# EAGLE schematic Kord Kontroller PCB 0.2 (EAGLE 9.6.2)

## Sheet 1 of 2
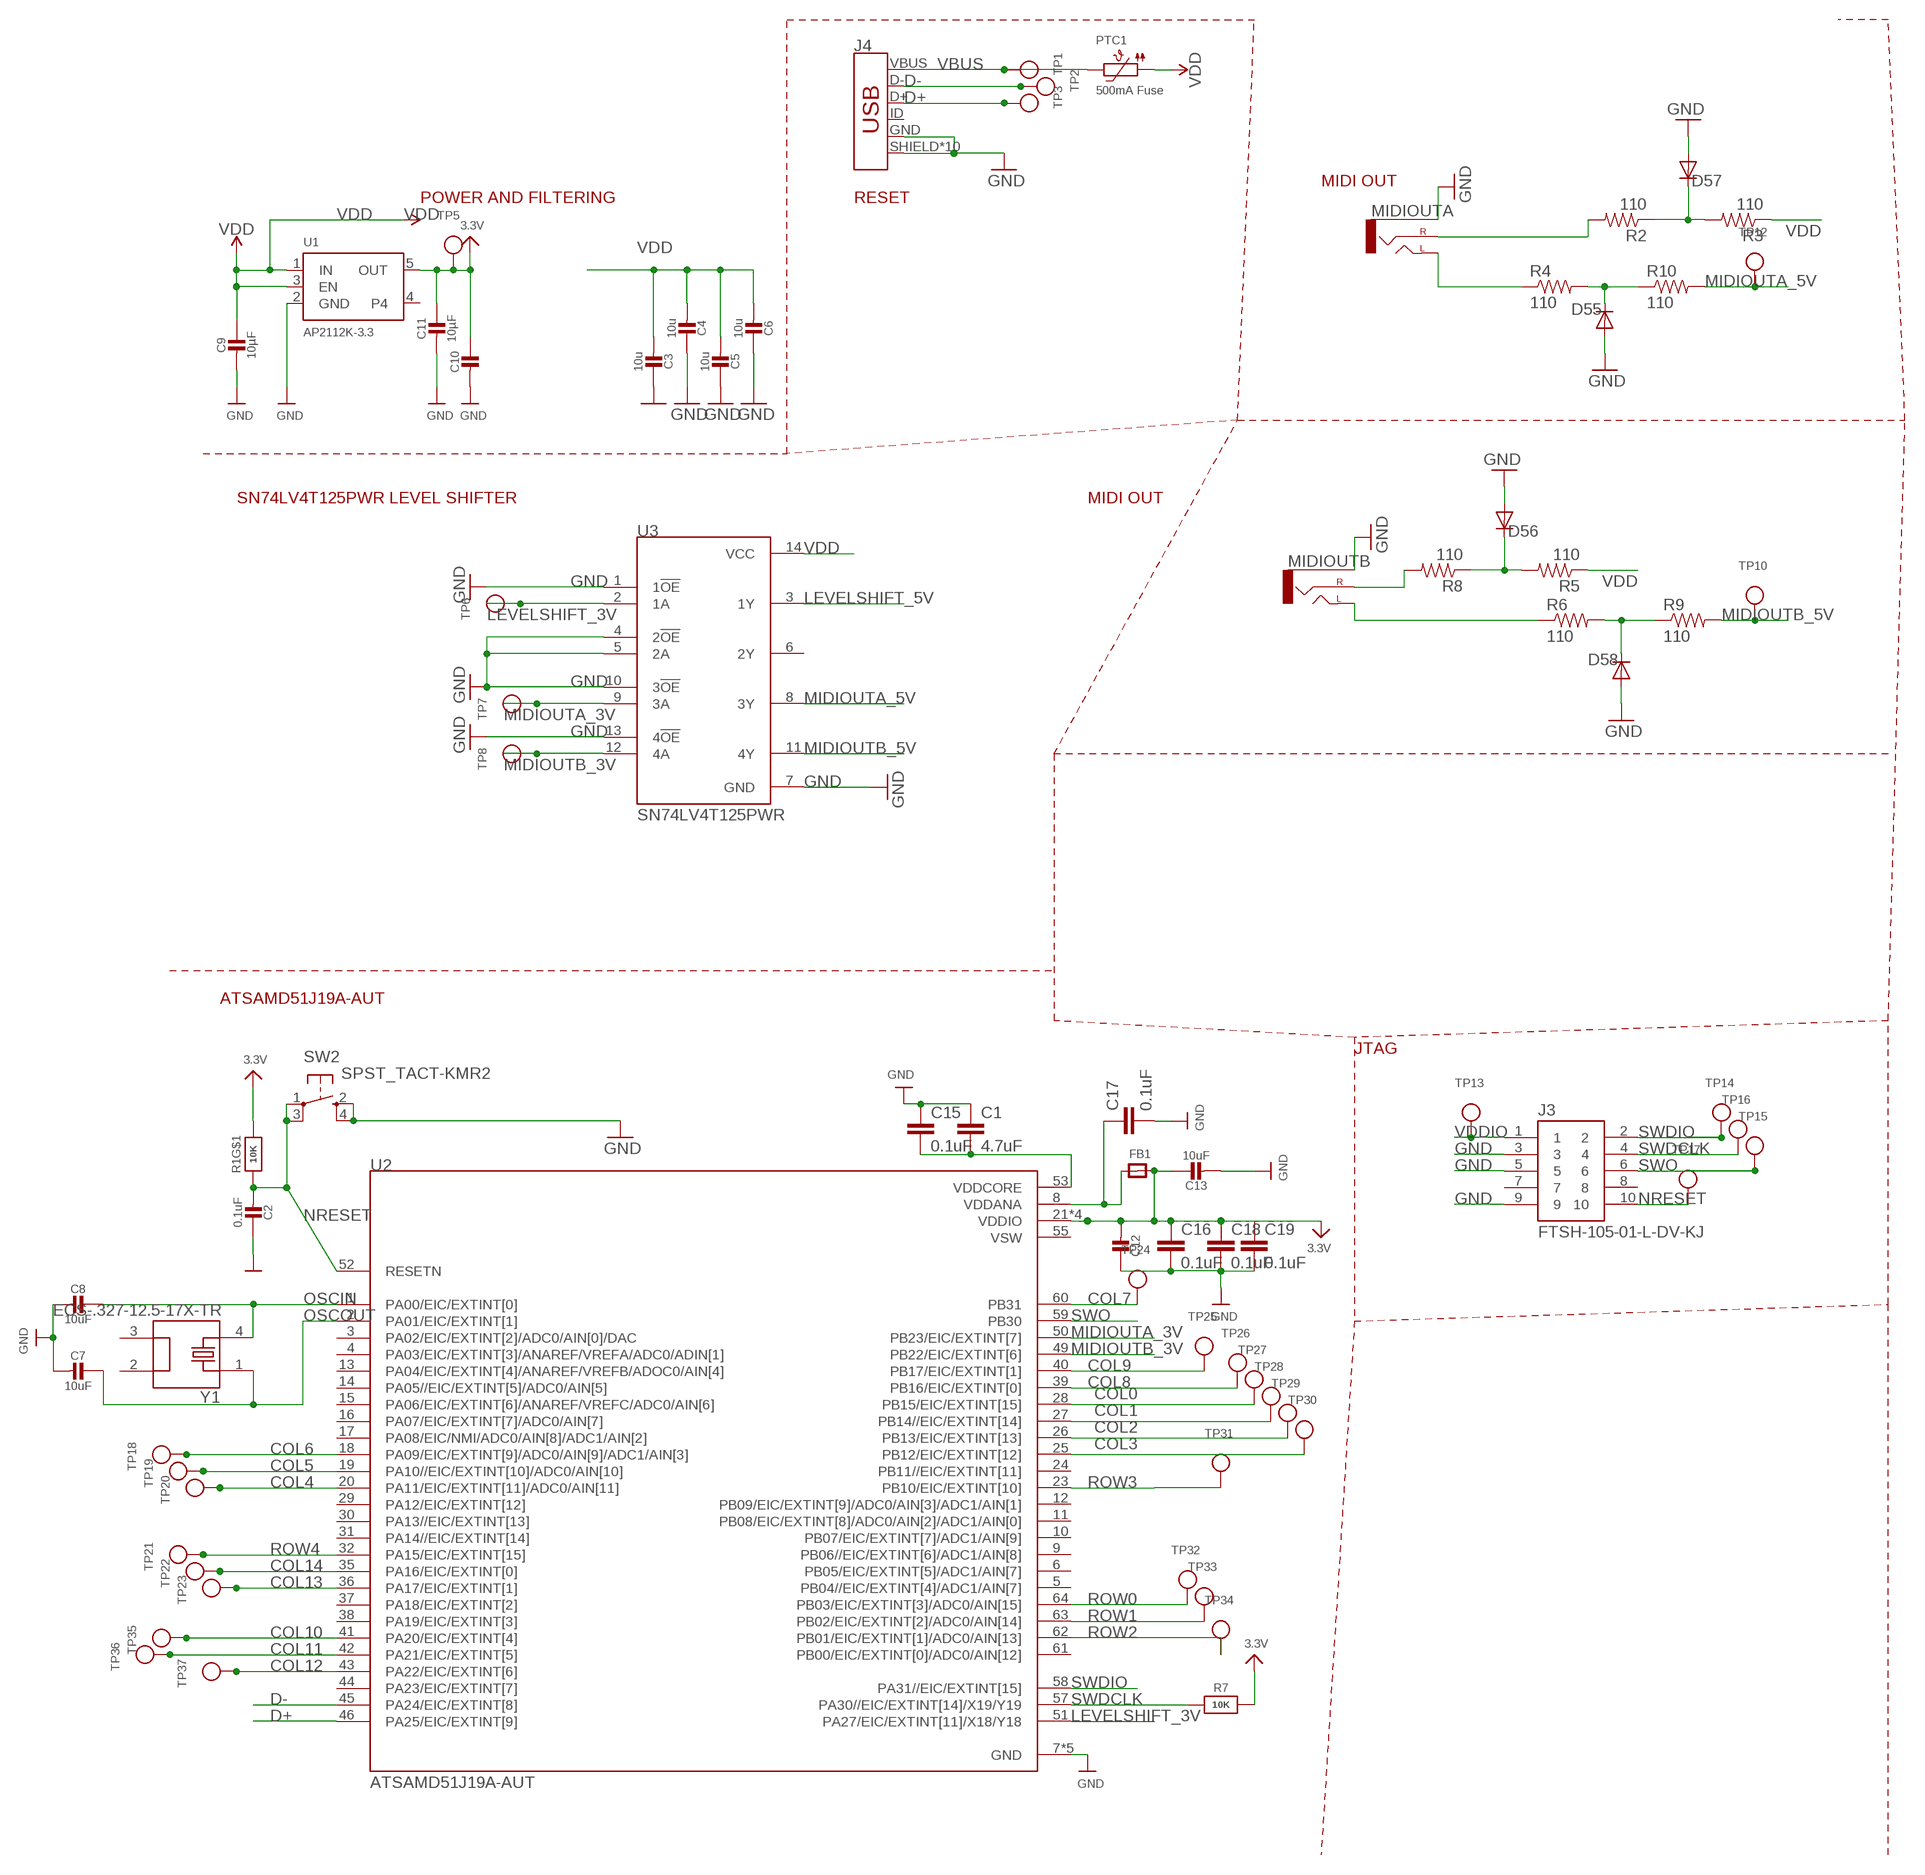
[diagram p0: schematic, sheet 1]

### Parts
C1  4.7uF  4.7UF-0603-6.3V-(10%)  [0603]
C2  0.1uF  CAP_CERAMIC0603_NO  [0603-NO]
C3  10u  CAP_CERAMIC0805-NOOUTLINE  [0805-NO]
C4  10u  CAP_CERAMIC0805-NOOUTLINE  [0805-NO]
C5  10u  CAP_CERAMIC0805-NOOUTLINE  [0805-NO]
C6  10u  CAP_CERAMIC0805-NOOUTLINE  [0805-NO]
C7  10uF  CAP_CERAMIC0805-NOOUTLINE  [0805-NO]
C8  10uF  CAP_CERAMIC0805-NOOUTLINE  [0805-NO]
C9  10µF  CAP_CERAMIC0805-NOOUTLINE  [0805-NO]
C10  1uF  CAP_CERAMIC0603_NO  [0603-NO]
C11  10µF  CAP_CERAMIC0805-NOOUTLINE  [0805-NO]
C12  1uF  CAP_CERAMIC0603_NO  [0603-NO]
C13  10uF  CAP_CERAMIC0805-NOOUTLINE  [0805-NO]
C15  0.1uF  0.1UF-0603-25V-(+80/-20%)  [0603]
C16  0.1uF  0.1UF-0603-25V-(+80/-20%)  [0603]
C17  0.1uF  0.1UF-0603-25V-(+80/-20%)  [0603]
C18  0.1uF  0.1UF-0603-25V-(+80/-20%)  [0603]
C19  0.1uF  0.1UF-0603-25V-(+80/-20%)  [0603]
D55  DIODE-SOD123  [SOD123]
D56  DIODE-SOD123  [SOD123]
D57  DIODE-SOD123  [SOD123]
D58  DIODE-SOD123  [SOD123]
FB1  FERRITE  [0603]
J3  FTSH-105-01-L-DV-KJ  [SAMTEC_FTSH-105-01-L-DV-K]
J4  USB_MICRO-B_HALF_PTH_MILL  [USB-MICROB-PTH-MILL]
MIDIOUTA  AUDIO_JACK_2.5MM_2.5MM_SMD  [STEREOJACK2.5MM]
MIDIOUTB  AUDIO_JACK_2.5MM_2.5MM_SMD  [STEREOJACK2.5MM]
PTC1  500mA Fuse  PTC1206  [1206]
R1  10K  RESISTOR_4PACK  [RESPACK_4X0603]
R2  110  220OHM-1/10W-1%(0603)  [0603-RES]
R3  110  220OHM-1/10W-1%(0603)  [0603-RES]
R4  110  220OHM-1/10W-1%(0603)  [0603-RES]
R5  110  220OHM-1/10W-1%(0603)  [0603-RES]
R6  110  220OHM-1/10W-1%(0603)  [0603-RES]
R7  10K  RESISTOR_0603_NOOUT  [0603-NO]
R8  110  220OHM-1/10W-1%(0603)  [0603-RES]
R9  110  220OHM-1/10W-1%(0603)  [0603-RES]
R10  110  220OHM-1/10W-1%(0603)  [0603-RES]
SW2  SPST_TACT-KMR2  [KMR2]
TP1  TESTPOINTROUND1MM  [TESTPOINT_ROUND_1MM]
TP2  TESTPOINTROUND1MM  [TESTPOINT_ROUND_1MM]
TP3  TESTPOINTROUND1MM  [TESTPOINT_ROUND_1MM]
TP5  TESTPOINTROUND1MM  [TESTPOINT_ROUND_1MM]
TP6  TESTPOINTROUND1MM  [TESTPOINT_ROUND_1MM]
TP7  TESTPOINTROUND1MM  [TESTPOINT_ROUND_1MM]
TP8  TESTPOINTROUND1MM  [TESTPOINT_ROUND_1MM]
TP10  TESTPOINTROUND1MM  [TESTPOINT_ROUND_1MM]
TP12  TESTPOINTROUND1MM  [TESTPOINT_ROUND_1MM]
TP13  TESTPOINTROUND1MM  [TESTPOINT_ROUND_1MM]
TP14  TESTPOINTROUND1MM  [TESTPOINT_ROUND_1MM]
TP15  TESTPOINTROUND1MM  [TESTPOINT_ROUND_1MM]
TP16  TESTPOINTROUND1MM  [TESTPOINT_ROUND_1MM]
TP17  TESTPOINTROUND1MM  [TESTPOINT_ROUND_1MM]
TP18  TESTPOINTROUND1MM  [TESTPOINT_ROUND_1MM]
TP19  TESTPOINTROUND1MM  [TESTPOINT_ROUND_1MM]
TP20  TESTPOINTROUND1MM  [TESTPOINT_ROUND_1MM]
TP21  TESTPOINTROUND1MM  [TESTPOINT_ROUND_1MM]
TP22  TESTPOINTROUND1MM  [TESTPOINT_ROUND_1MM]
TP23  TESTPOINTROUND1MM  [TESTPOINT_ROUND_1MM]
TP24  TESTPOINTROUND1MM  [TESTPOINT_ROUND_1MM]
TP25  TESTPOINTROUND1MM  [TESTPOINT_ROUND_1MM]
TP26  TESTPOINTROUND1MM  [TESTPOINT_ROUND_1MM]
TP27  TESTPOINTROUND1MM  [TESTPOINT_ROUND_1MM]
TP28  TESTPOINTROUND1MM  [TESTPOINT_ROUND_1MM]
TP29  TESTPOINTROUND1MM  [TESTPOINT_ROUND_1MM]
TP30  TESTPOINTROUND1MM  [TESTPOINT_ROUND_1MM]
TP31  TESTPOINTROUND1MM  [TESTPOINT_ROUND_1MM]
TP32  TESTPOINTROUND1MM  [TESTPOINT_ROUND_1MM]
TP33  TESTPOINTROUND1MM  [TESTPOINT_ROUND_1MM]
TP34  TESTPOINTROUND1MM  [TESTPOINT_ROUND_1MM]
TP35  TESTPOINTROUND1MM  [TESTPOINT_ROUND_1MM]
TP36  TESTPOINTROUND1MM  [TESTPOINT_ROUND_1MM]
TP37  TESTPOINTROUND1MM  [TESTPOINT_ROUND_1MM]
U1  AP2112K-3.3  VREG_SOT23-5  [SOT23-5]
U2  ATSAMD51J19A-AUT  [QFP50P1200X1200X120-64N]
U3  SN74LV4T125PWR  [SOP65P640X120-14N]
Y1  ECS-.327-12.5-17X-TR  [XTAL_ECS-.327-12.5-17X-TR]

### Nets
COL0: TP27.P$1 U2.28(PB15/EIC/EXTINT[15]) ; also sheet 2
COL1: TP28.P$1 U2.27(PB14//EIC/EXTINT[14]) ; also sheet 2
COL2: TP29.P$1 U2.26(PB13/EIC/EXTINT[13]) ; also sheet 2
COL3: TP30.P$1 U2.25(PB12/EIC/EXTINT[12]) ; also sheet 2
COL4: TP20.P$1 U2.20(PA11/EIC/EXTINT[11]/ADC0/AIN[11]) ; also sheet 2
COL5: TP19.P$1 U2.19(PA10//EIC/EXTINT[10]/ADC0/AIN[10]) ; also sheet 2
COL6: TP18.P$1 U2.18(PA09/EIC/EXTINT[9]/ADC0/AIN[9]/ADC1/AIN[3]) ; also sheet 2
COL7: TP24.P$1 U2.60(PB31) ; also sheet 2
COL8: TP26.P$1 U2.39(PB16/EIC/EXTINT[0]) ; also sheet 2
COL9: TP25.P$1 U2.40(PB17/EIC/EXTINT[1]) ; also sheet 2
COL10: TP35.P$1 U2.41(PA20/EIC/EXTINT[4]) ; also sheet 2
COL11: TP36.P$1 U2.42(PA21/EIC/EXTINT[5]) ; also sheet 2
COL12: TP37.P$1 U2.43(PA22/EIC/EXTINT[6]) ; also sheet 2
COL13: TP23.P$1 U2.36(PA17/EIC/EXTINT[1]) ; also sheet 2
COL14: TP22.P$1 U2.35(PA16/EIC/EXTINT[0]) ; also sheet 2
D+: J4.D+ TP3.P$1 U2.46(PA25/EIC/EXTINT[9])
D-: J4.D- TP2.P$1 U2.45(PA24/EIC/EXTINT[8])
GND: C1.1 C2.1 C3.1 C4.1 C5.1 C6.1 C7.2 C8.2 C9.2 C10.2 C11.2 C12.1 C13.2 C15.1 C16.2 C17.2 C18.2 C19.2 D55.A D56.A D57.A D58.A J3.3 J3.5 J3.9 J4.GND J4.SHIELD J4.SHIELD2(SHIELD) J4.SHIELD3(SHIELD) J4.SHIELD4(SHIELD) J4.SHIELD5(SHIELD) J4.SHIELD6(SHIELD) J4.SHIELD7(SHIELD) J4.SHIELD8(SHIELD) J4.SHIELD9(SHIELD) J4.SHIELD10(SHIELD) MIDIOUTA.5(SLEEVE) MIDIOUTB.5(SLEEVE) SW2.2(S) SW2.4(S1) U1.2(GND) U2.7(GND) U2.22(GND) U2.33(GND) U2.47(GND) U2.54(GND) U3.1(1!OE) U3.4(2!OE) U3.5(2A) U3.7(GND) U3.10(3!OE) U3.13(4!OE) ; also sheet 2
LEVELSHIFT_3V: TP6.P$1 U2.51(PA27/EIC/EXTINT[11]/X18/Y18) U3.2(1A)
LEVELSHIFT_5V: U3.3(1Y) ; also sheet 2
MIDIOUTA_3V: TP7.P$1 U2.50(PB23/EIC/EXTINT[7]) U3.9(3A)
MIDIOUTA_5V: R10.2 TP12.P$1 U3.8(3Y)
MIDIOUTB_3V: TP8.P$1 U2.49(PB22/EIC/EXTINT[6]) U3.12(4A)
MIDIOUTB_5V: R9.2 TP10.P$1 U3.11(4Y)
N$1: MIDIOUTB.1(LEFT) R6.1
N$2: D58.C R6.2 R9.1
N$63: D57.C R2.1 R3.2
N$66: MIDIOUTA.4(RIGHT) R2.2
N$69: D55.C R4.2 R10.1
N$71: D56.C R5.2 R8.1
N$72: MIDIOUTB.4(RIGHT) R8.2
N$110: MIDIOUTA.1(LEFT) R4.1
NRESET: C2.2 J3.10 R1.1 SW2.1(P) SW2.3(P1) TP17.P$1 U2.52(RESETN)
OSCIN: C8.1 U2.1(PA00/EIC/EXTINT[0]) Y1.4
OSCOUT: C7.1 U2.2(PA01/EIC/EXTINT[1]) Y1.1
ROW0: TP32.P$1 U2.64(PB03/EIC/EXTINT[3]/ADC0/AIN[15]) ; also sheet 2
ROW1: TP33.P$1 U2.63(PB02/EIC/EXTINT[2]/ADC0/AIN[14]) ; also sheet 2
ROW2: TP34.P$1 U2.62(PB01/EIC/EXTINT[1]/ADC0/AIN[13]) ; also sheet 2
ROW3: TP31.P$1 U2.23(PB10/EIC/EXTINT[10]) ; also sheet 2
ROW4: TP21.P$1 U2.32(PA15/EIC/EXTINT[15]) ; also sheet 2
SWDCLK: J3.4 R7.1 TP16.P$1 U2.57(PA30//EIC/EXTINT[14]/X19/Y19)
SWDIO: J3.2 TP14.P$1 U2.58(PA31//EIC/EXTINT[15])
SWO: J3.6 TP15.P$1 U2.59(PB30)
VBUS: J4.VBUS PTC1.2 TP1.P$1
VDD [power]: C3.2 C4.2 C5.2 C6.2 C9.1 PTC1.1 R3.1 R5.1 U1.1(IN) U1.3(EN) U3.14(VCC) ; also sheet 2
VDDANA: C17.1 FB1.1 U2.8(VDDANA)
VDDCORE1: C1.2 C15.2 U2.53(VDDCORE)
VDDIO: C10.1 C11.1 C12.2 C13.1 C16.1 C18.1 C19.1 FB1.2 J3.1 R1.8 R7.2 TP5.P$1 TP13.P$1 U1.5(OUT) U2.21(VDDIO) U2.34(VDDIO) U2.48(VDDIO) U2.56(VDDIO) ; supply symbol labelled 3.3V
Unconnected: J3.7 J3.8 J4.ID R1.2 R1.3 R1.4 R1.5 R1.6 R1.7 U1.4 U2.3(PA02/EIC/EXTINT[2]/ADC0/AIN[0]/DAC) U2.4(PA03/EIC/EXTINT[3]/ANAREF/VREFA/ADC0/ADIN[1]) U2.5(PB04//EIC/EXTINT[4]/ADC1/AIN[7]) U2.6(PB05/EIC/EXTINT[5]/ADC1/AIN[7]) U2.9(PB06//EIC/EXTINT[6]/ADC1/AIN[8]) U2.10(PB07/EIC/EXTINT[7]/ADC1/AIN[9]) U2.11(PB08/EIC/EXTINT[8]/ADC0/AIN[2]/ADC1/AIN[0]) U2.12(PB09/EIC/EXTINT[9]/ADC0/AIN[3]/ADC1/AIN[1]) U2.13(PA04/EIC/EXTINT[4]/ANAREF/VREFB/ADOC0/AIN[4]) U2.14(PA05//EIC/EXTINT[5]/ADC0/AIN[5]) U2.15(PA06/EIC/EXTINT[6]/ANAREF/VREFC/ADC0/AIN[6]) U2.16(PA07/EIC/EXTINT[7]/ADC0/AIN[7]) U2.17(PA08/EIC/NMI/ADC0/AIN[8]/ADC1/AIN[2]) U2.24(PB11//EIC/EXTINT[11]) U2.29(PA12/EIC/EXTINT[12]) U2.30(PA13//EIC/EXTINT[13]) U2.31(PA14//EIC/EXTINT[14]) U2.37(PA18/EIC/EXTINT[2]) U2.38(PA19/EIC/EXTINT[3]) U2.44(PA23/EIC/EXTINT[7]) U2.61(PB00/EIC/EXTINT[0]/ADC0/AIN[12]) U3.6(2Y) Y1.2 Y1.3

### Notes on the sheet
- MIDI OUT
- POWER AND FILTERING | RESET
- SN74LV4T125PWR LEVEL SHIFTER | MIDI OUT
- ATSAMD51J19A-AUT
- JTAG

## Sheet 2 of 2
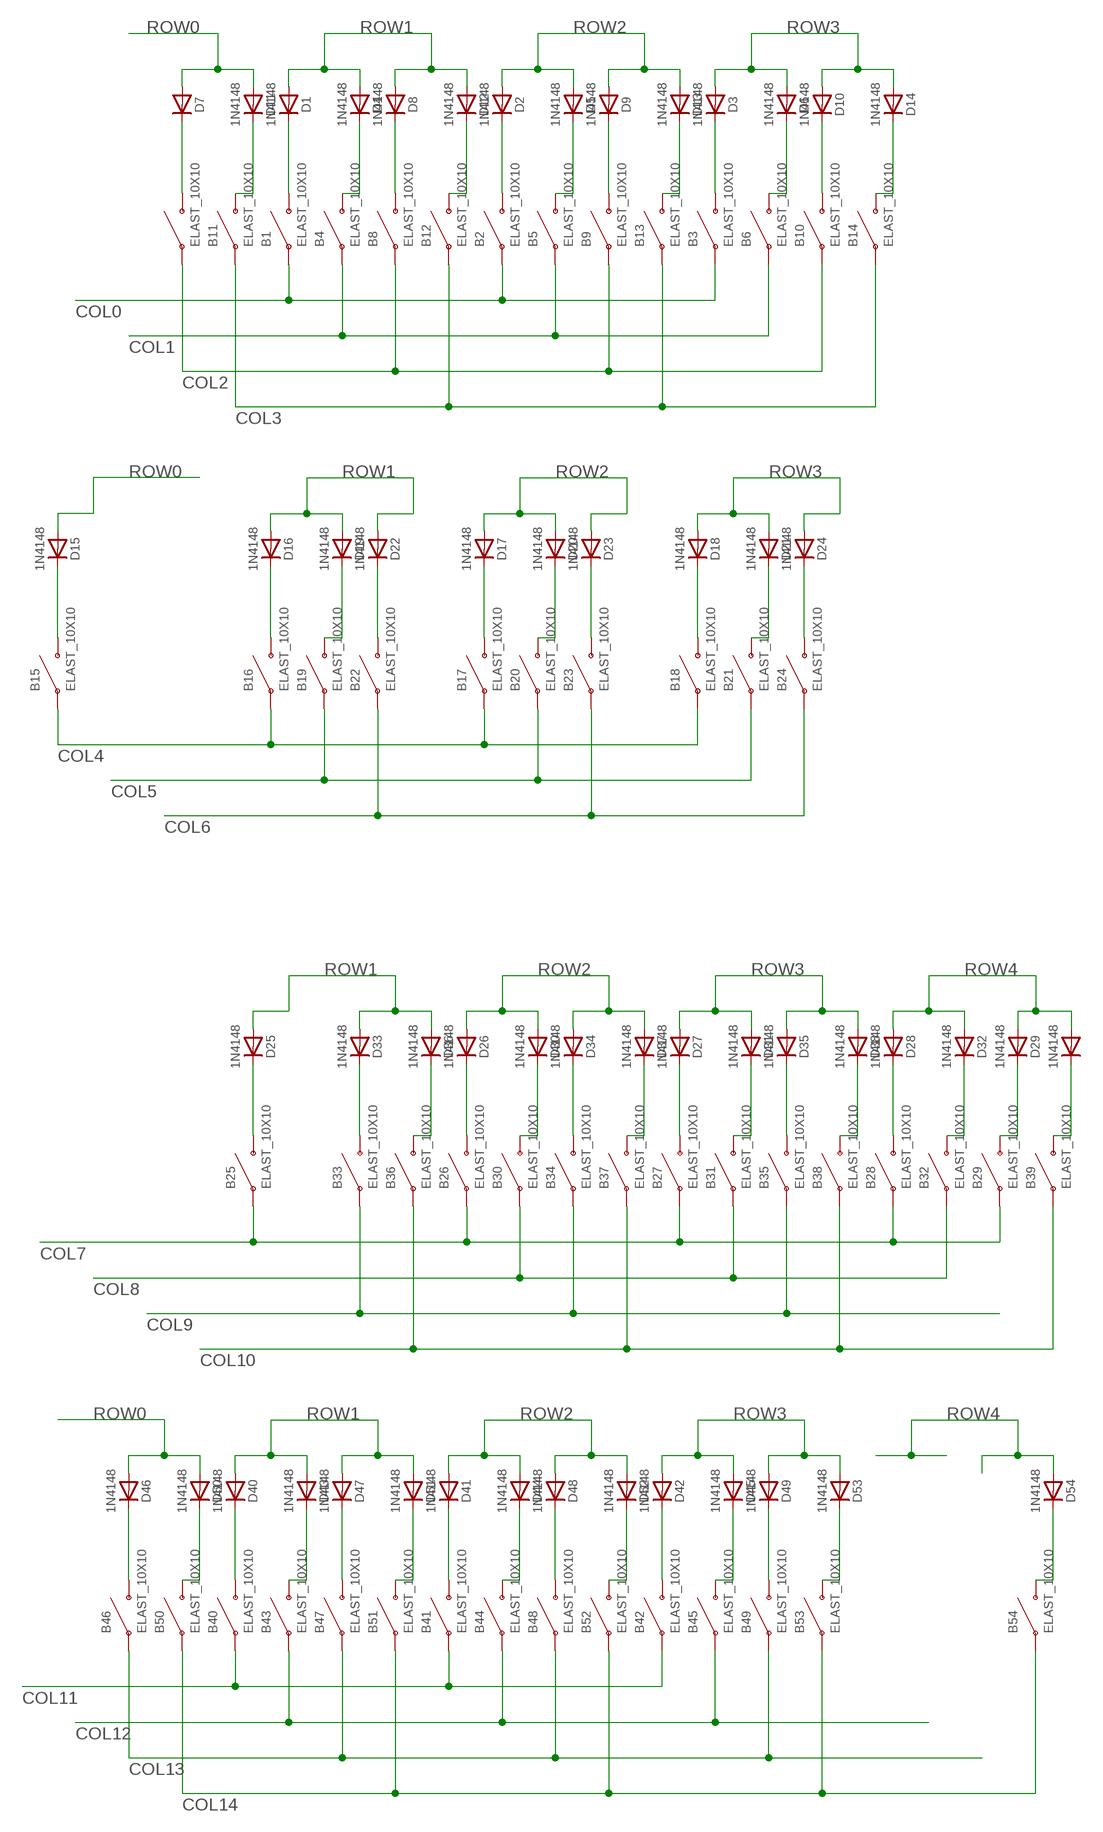
[diagram p1: schematic, sheet 2, part 1 of 2]
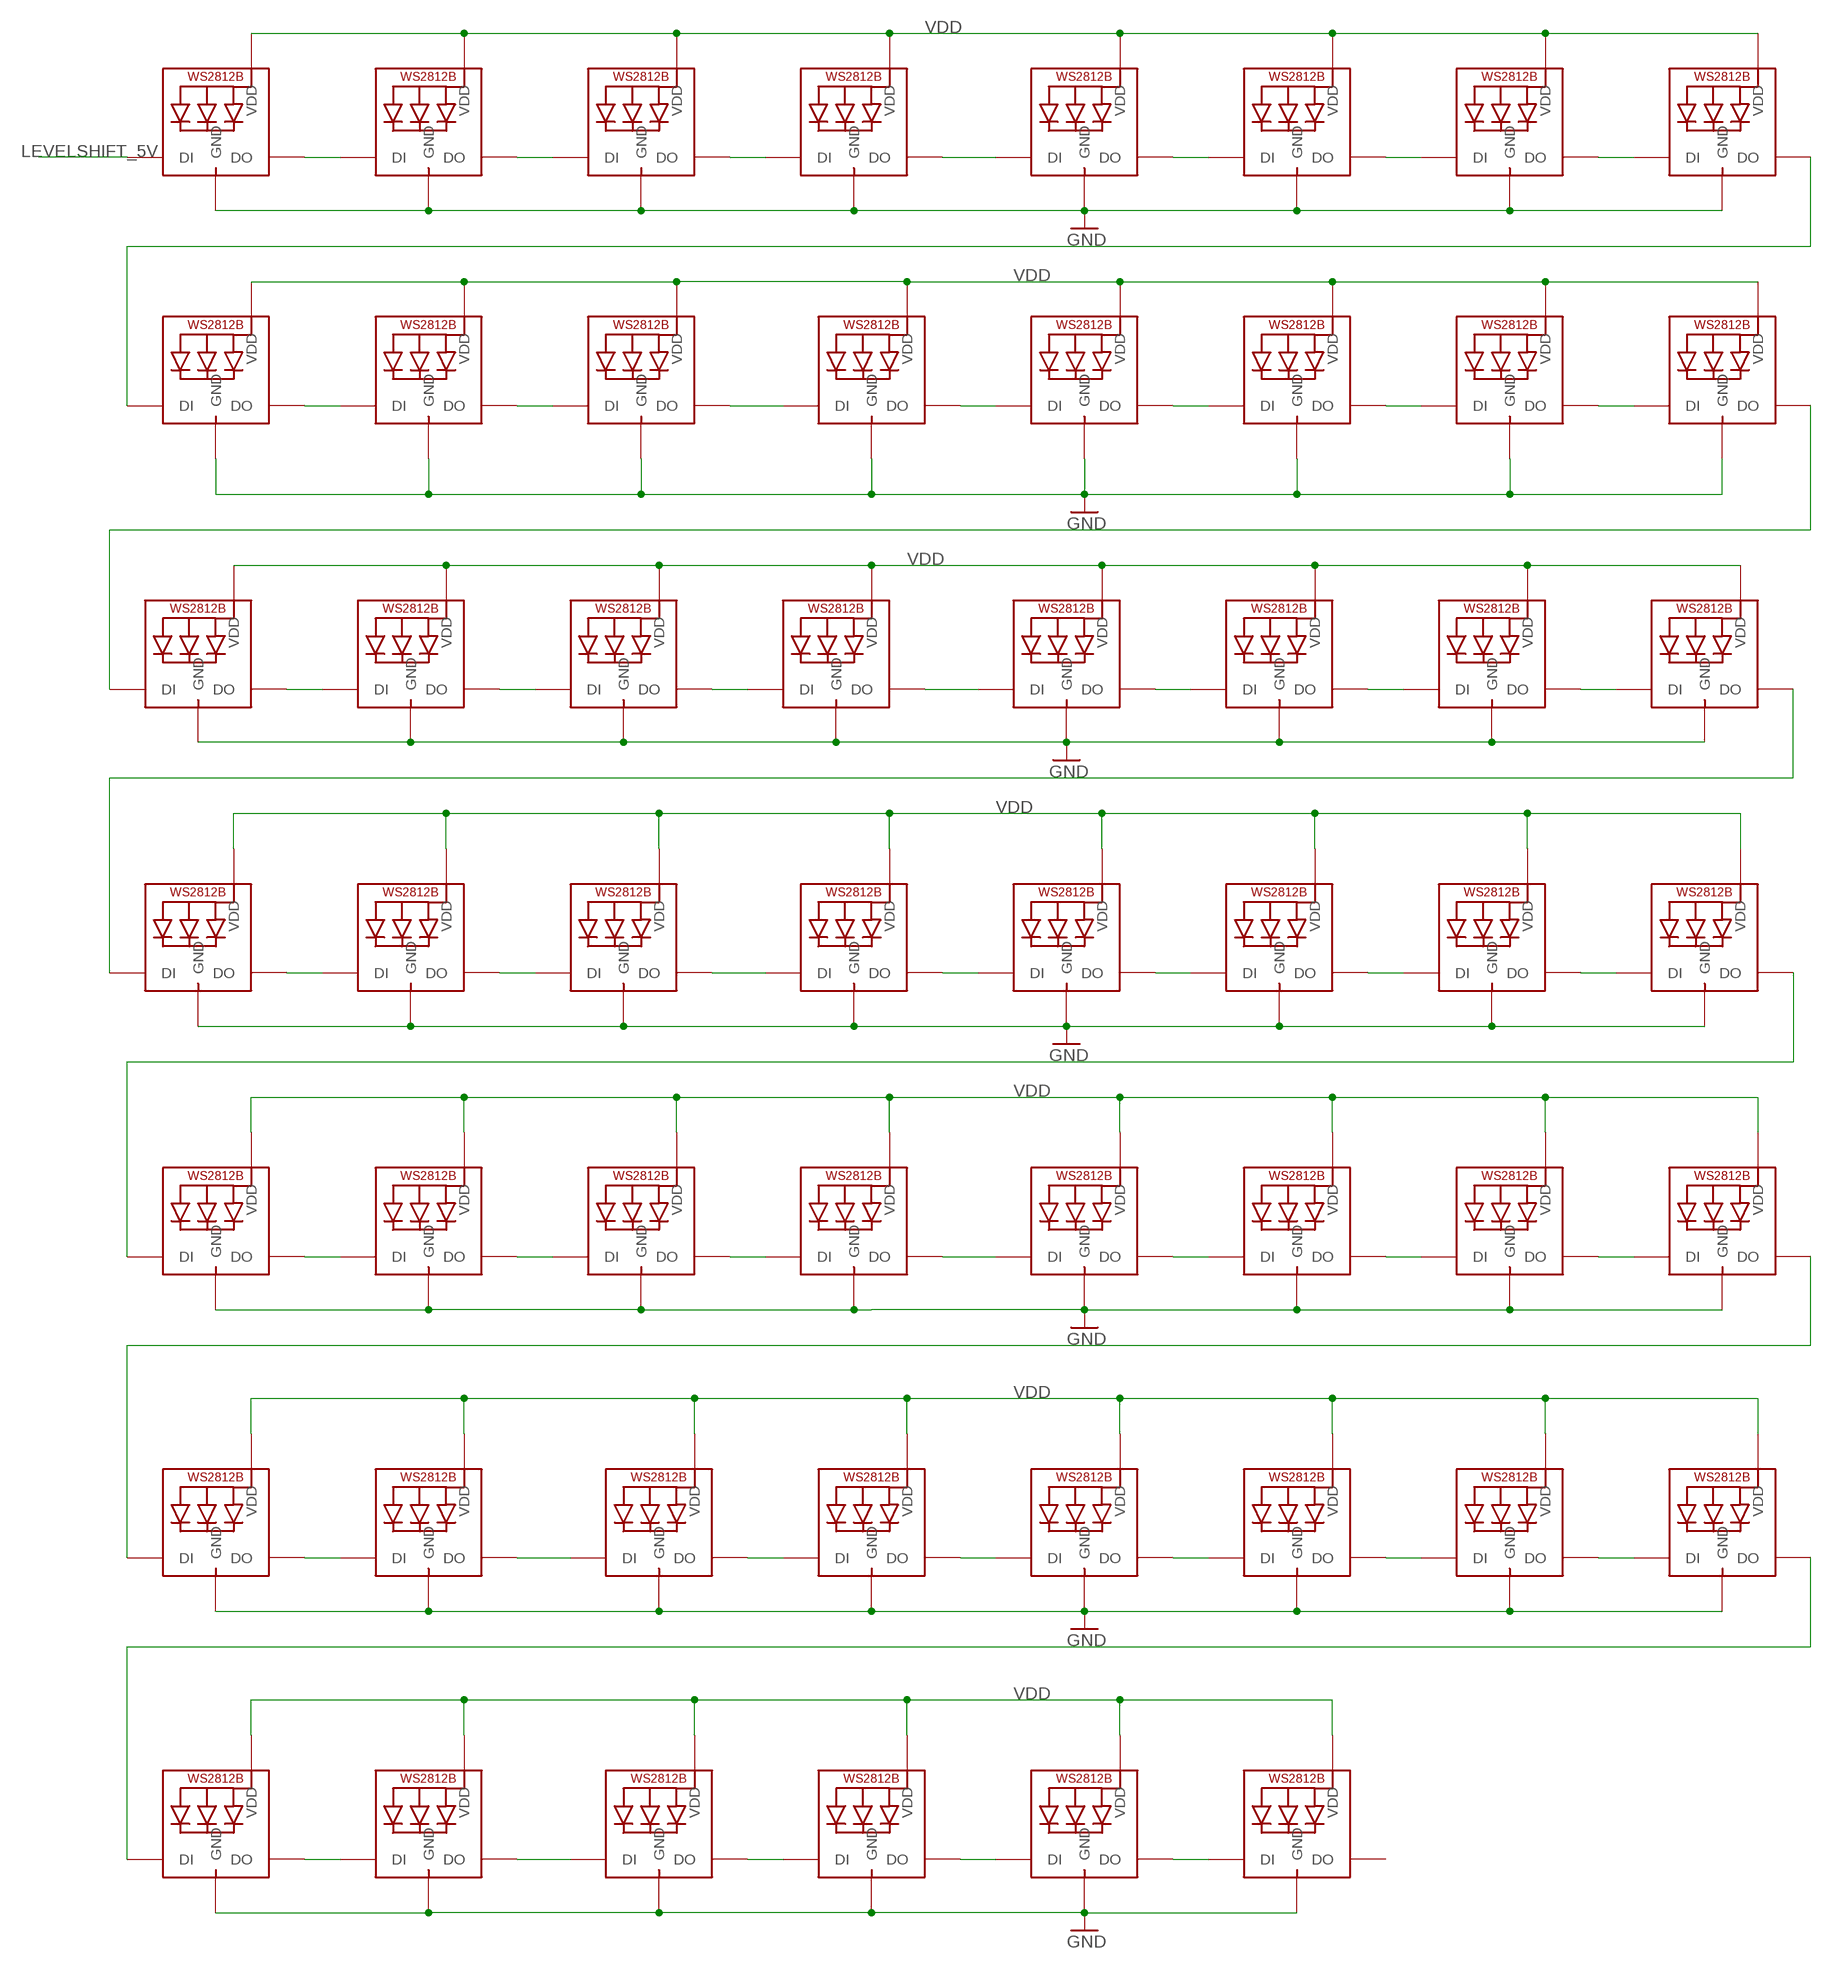
[diagram p2: schematic, sheet 2, part 2 of 2]

### Parts
B1  ELAST_10X10  [ELAST_PAD_SQUARE_10MM_4X4WIDE]
B2  ELAST_10X10  [ELAST_PAD_SQUARE_10MM_4X4WIDE]
B3  ELAST_10X10  [ELAST_PAD_SQUARE_10MM_4X4WIDE]
B4  ELAST_10X10  [ELAST_PAD_SQUARE_10MM_4X4WIDE]
B5  ELAST_10X10  [ELAST_PAD_SQUARE_10MM_4X4WIDE]
B6  ELAST_10X10  [ELAST_PAD_SQUARE_10MM_4X4WIDE]
B7  ELAST_10X10  [ELAST_PAD_SQUARE_10MM_4X4WIDE]
B8  ELAST_10X10  [ELAST_PAD_SQUARE_10MM_4X4WIDE]
B9  ELAST_10X10  [ELAST_PAD_SQUARE_10MM_4X4WIDE]
B10  ELAST_10X10  [ELAST_PAD_SQUARE_10MM_4X4WIDE]
B11  ELAST_10X10  [ELAST_PAD_SQUARE_10MM_4X4WIDE]
B12  ELAST_10X10  [ELAST_PAD_SQUARE_10MM_4X4WIDE]
B13  ELAST_10X10  [ELAST_PAD_SQUARE_10MM_4X4WIDE]
B14  ELAST_10X10  [ELAST_PAD_SQUARE_10MM_4X4WIDE]
B15  ELAST_10X10  [ELAST_PAD_SQUARE_10MM_4X4WIDE]
B16  ELAST_10X10  [ELAST_PAD_SQUARE_10MM_4X4WIDE]
B17  ELAST_10X10  [ELAST_PAD_SQUARE_10MM_4X4WIDE]
B18  ELAST_10X10  [ELAST_PAD_SQUARE_10MM_4X4WIDE]
B19  ELAST_10X10  [ELAST_PAD_SQUARE_10MM_4X4WIDE]
B20  ELAST_10X10  [ELAST_PAD_SQUARE_10MM_4X4WIDE]
B21  ELAST_10X10  [ELAST_PAD_SQUARE_10MM_4X4WIDE]
B22  ELAST_10X10  [ELAST_PAD_SQUARE_10MM_4X4WIDE]
B23  ELAST_10X10  [ELAST_PAD_SQUARE_10MM_4X4WIDE]
B24  ELAST_10X10  [ELAST_PAD_SQUARE_10MM_4X4WIDE]
B25  ELAST_10X10  [ELAST_PAD_SQUARE_10MM_4X4WIDE]
B26  ELAST_10X10  [ELAST_PAD_SQUARE_10MM_4X4WIDE]
B27  ELAST_10X10  [ELAST_PAD_SQUARE_10MM_4X4WIDE]
B28  ELAST_10X10  [ELAST_PAD_SQUARE_10MM_4X4WIDE]
B29  ELAST_10X10  [ELAST_PAD_SQUARE_10MM_4X4WIDE]
B30  ELAST_10X10  [ELAST_PAD_SQUARE_10MM_4X4WIDE]
B31  ELAST_10X10  [ELAST_PAD_SQUARE_10MM_4X4WIDE]
B32  ELAST_10X10  [ELAST_PAD_SQUARE_10MM_4X4WIDE]
B33  ELAST_10X10  [ELAST_PAD_SQUARE_10MM_4X4WIDE]
B34  ELAST_10X10  [ELAST_PAD_SQUARE_10MM_4X4WIDE]
B35  ELAST_10X10  [ELAST_PAD_SQUARE_10MM_4X4WIDE]
B36  ELAST_10X10  [ELAST_PAD_SQUARE_10MM_4X4WIDE]
B37  ELAST_10X10  [ELAST_PAD_SQUARE_10MM_4X4WIDE]
B38  ELAST_10X10  [ELAST_PAD_SQUARE_10MM_4X4WIDE]
B39  ELAST_10X10  [ELAST_PAD_SQUARE_10MM_4X4WIDE]
B40  ELAST_10X10  [ELAST_PAD_SQUARE_10MM_4X4WIDE]
B41  ELAST_10X10  [ELAST_PAD_SQUARE_10MM_4X4WIDE]
B42  ELAST_10X10  [ELAST_PAD_SQUARE_10MM_4X4WIDE]
B43  ELAST_10X10  [ELAST_PAD_SQUARE_10MM_4X4WIDE]
B44  ELAST_10X10  [ELAST_PAD_SQUARE_10MM_4X4WIDE]
B45  ELAST_10X10  [ELAST_PAD_SQUARE_10MM_4X4WIDE]
B46  ELAST_10X10  [ELAST_PAD_SQUARE_10MM_4X4WIDE]
B47  ELAST_10X10  [ELAST_PAD_SQUARE_10MM_4X4WIDE]
B48  ELAST_10X10  [ELAST_PAD_SQUARE_10MM_4X4WIDE]
B49  ELAST_10X10  [ELAST_PAD_SQUARE_10MM_4X4WIDE]
B50  ELAST_10X10  [ELAST_PAD_SQUARE_10MM_4X4WIDE]
B51  ELAST_10X10  [ELAST_PAD_SQUARE_10MM_4X4WIDE]
B52  ELAST_10X10  [ELAST_PAD_SQUARE_10MM_4X4WIDE]
B53  ELAST_10X10  [ELAST_PAD_SQUARE_10MM_4X4WIDE]
B54  ELAST_10X10  [ELAST_PAD_SQUARE_10MM_4X4WIDE]
D1  1N4148  DIODESOD-323  [SOD-323]
D2  1N4148  DIODESOD-323  [SOD-323]
D3  1N4148  DIODESOD-323  [SOD-323]
D4  1N4148  DIODESOD-323  [SOD-323]
D5  1N4148  DIODESOD-323  [SOD-323]
D6  1N4148  DIODESOD-323  [SOD-323]
D7  1N4148  DIODESOD-323  [SOD-323]
D8  1N4148  DIODESOD-323  [SOD-323]
D9  1N4148  DIODESOD-323  [SOD-323]
D10  1N4148  DIODESOD-323  [SOD-323]
D11  1N4148  DIODESOD-323  [SOD-323]
D12  1N4148  DIODESOD-323  [SOD-323]
D13  1N4148  DIODESOD-323  [SOD-323]
D14  1N4148  DIODESOD-323  [SOD-323]
D15  1N4148  DIODESOD-323  [SOD-323]
D16  1N4148  DIODESOD-323  [SOD-323]
D17  1N4148  DIODESOD-323  [SOD-323]
D18  1N4148  DIODESOD-323  [SOD-323]
D19  1N4148  DIODESOD-323  [SOD-323]
D20  1N4148  DIODESOD-323  [SOD-323]
D21  1N4148  DIODESOD-323  [SOD-323]
D22  1N4148  DIODESOD-323  [SOD-323]
D23  1N4148  DIODESOD-323  [SOD-323]
D24  1N4148  DIODESOD-323  [SOD-323]
D25  1N4148  DIODESOD-323  [SOD-323]
D26  1N4148  DIODESOD-323  [SOD-323]
D27  1N4148  DIODESOD-323  [SOD-323]
D28  1N4148  DIODESOD-323  [SOD-323]
D29  1N4148  DIODESOD-323  [SOD-323]
D30  1N4148  DIODESOD-323  [SOD-323]
D31  1N4148  DIODESOD-323  [SOD-323]
D32  1N4148  DIODESOD-323  [SOD-323]
D33  1N4148  DIODESOD-323  [SOD-323]
D34  1N4148  DIODESOD-323  [SOD-323]
D35  1N4148  DIODESOD-323  [SOD-323]
D36  1N4148  DIODESOD-323  [SOD-323]
D37  1N4148  DIODESOD-323  [SOD-323]
D38  1N4148  DIODESOD-323  [SOD-323]
D39  1N4148  DIODESOD-323  [SOD-323]
D40  1N4148  DIODESOD-323  [SOD-323]
D41  1N4148  DIODESOD-323  [SOD-323]
D42  1N4148  DIODESOD-323  [SOD-323]
D43  1N4148  DIODESOD-323  [SOD-323]
D44  1N4148  DIODESOD-323  [SOD-323]
D45  1N4148  DIODESOD-323  [SOD-323]
D46  1N4148  DIODESOD-323  [SOD-323]
D47  1N4148  DIODESOD-323  [SOD-323]
D48  1N4148  DIODESOD-323  [SOD-323]
D49  1N4148  DIODESOD-323  [SOD-323]
D50  1N4148  DIODESOD-323  [SOD-323]
D51  1N4148  DIODESOD-323  [SOD-323]
D52  1N4148  DIODESOD-323  [SOD-323]
D53  1N4148  DIODESOD-323  [SOD-323]
D54  1N4148  DIODESOD-323  [SOD-323]
LED1  WS2812BHRGB32M  [LED3535]
LED2  WS2812BHRGB32M  [LED3535]
LED3  WS2812BHRGB32M  [LED3535]
LED4  WS2812BHRGB32M  [LED3535]
LED5  WS2812BHRGB32M  [LED3535]
LED6  WS2812BHRGB32M  [LED3535]
LED7  WS2812BHRGB32M  [LED3535]
LED8  WS2812BHRGB32M  [LED3535]
LED9  WS2812BHRGB32M  [LED3535]
LED10  WS2812BHRGB32M  [LED3535]
LED11  WS2812BHRGB32M  [LED3535]
LED12  WS2812BHRGB32M  [LED3535]
LED13  WS2812BHRGB32M  [LED3535]
LED14  WS2812BHRGB32M  [LED3535]
LED15  WS2812BHRGB32M  [LED3535]
LED16  WS2812BHRGB32M  [LED3535]
LED17  WS2812BHRGB32M  [LED3535]
LED18  WS2812BHRGB32M  [LED3535]
LED19  WS2812BHRGB32M  [LED3535]
LED20  WS2812BHRGB32M  [LED3535]
LED21  WS2812BHRGB32M  [LED3535]
LED22  WS2812BHRGB32M  [LED3535]
LED23  WS2812BHRGB32M  [LED3535]
LED24  WS2812BHRGB32M  [LED3535]
LED25  WS2812BHRGB32M  [LED3535]
LED26  WS2812BHRGB32M  [LED3535]
LED27  WS2812BHRGB32M  [LED3535]
LED28  WS2812BHRGB32M  [LED3535]
LED29  WS2812BHRGB32M  [LED3535]
LED30  WS2812BHRGB32M  [LED3535]
LED31  WS2812BHRGB32M  [LED3535]
LED32  WS2812BHRGB32M  [LED3535]
LED33  WS2812BHRGB32M  [LED3535]
LED34  WS2812BHRGB32M  [LED3535]
LED35  WS2812BHRGB32M  [LED3535]
LED36  WS2812BHRGB32M  [LED3535]
LED37  WS2812BHRGB32M  [LED3535]
LED38  WS2812BHRGB32M  [LED3535]
LED39  WS2812BHRGB32M  [LED3535]
LED40  WS2812BHRGB32M  [LED3535]
LED41  WS2812BHRGB32M  [LED3535]
LED42  WS2812BHRGB32M  [LED3535]
LED43  WS2812BHRGB32M  [LED3535]
LED44  WS2812BHRGB32M  [LED3535]
LED45  WS2812BHRGB32M  [LED3535]
LED46  WS2812BHRGB32M  [LED3535]
LED47  WS2812BHRGB32M  [LED3535]
LED48  WS2812BHRGB32M  [LED3535]
LED49  WS2812BHRGB32M  [LED3535]
LED50  WS2812BHRGB32M  [LED3535]
LED51  WS2812BHRGB32M  [LED3535]
LED52  WS2812BHRGB32M  [LED3535]
LED53  WS2812BHRGB32M  [LED3535]
LED54  WS2812BHRGB32M  [LED3535]

### Nets
COL0: B1.P$1 B2.P$1 B3.P$1 ; also sheet 1
COL1: B4.P$1 B5.P$1 B6.P$1 ; also sheet 1
COL2: B7.P$1 B8.P$1 B9.P$1 B10.P$1 ; also sheet 1
COL3: B11.P$1 B12.P$1 B13.P$1 B14.P$1 ; also sheet 1
COL4: B15.P$1 B16.P$1 B17.P$1 B18.P$1 ; also sheet 1
COL5: B19.P$1 B20.P$1 B21.P$1 ; also sheet 1
COL6: B22.P$1 B23.P$1 B24.P$1 ; also sheet 1
COL7: B25.P$1 B26.P$1 B27.P$1 B28.P$1 B29.P$1 ; also sheet 1
COL8: B30.P$1 B31.P$1 B32.P$1 ; also sheet 1
COL9: B33.P$1 B34.P$1 B35.P$1 ; also sheet 1
COL10: B36.P$1 B37.P$1 B38.P$1 B39.P$1 ; also sheet 1
COL11: B40.P$1 B41.P$1 B42.P$1 ; also sheet 1
COL12: B43.P$1 B44.P$1 B45.P$1 ; also sheet 1
COL13: B46.P$1 B47.P$1 B48.P$1 B49.P$1 ; also sheet 1
COL14: B50.P$1 B51.P$1 B52.P$1 B53.P$1 B54.P$1 ; also sheet 1
GND: LED1.3(GND) LED2.3(GND) LED3.3(GND) LED4.3(GND) LED5.3(GND) LED6.3(GND) LED7.3(GND) LED8.3(GND) LED9.3(GND) LED10.3(GND) LED11.3(GND) LED12.3(GND) LED13.3(GND) LED14.3(GND) LED15.3(GND) LED16.3(GND) LED17.3(GND) LED18.3(GND) LED19.3(GND) LED20.3(GND) LED21.3(GND) LED22.3(GND) LED23.3(GND) LED24.3(GND) LED25.3(GND) LED26.3(GND) LED27.3(GND) LED28.3(GND) LED29.3(GND) LED30.3(GND) LED31.3(GND) LED32.3(GND) LED33.3(GND) LED34.3(GND) LED35.3(GND) LED36.3(GND) LED37.3(GND) LED38.3(GND) LED39.3(GND) LED40.3(GND) LED41.3(GND) LED42.3(GND) LED43.3(GND) LED44.3(GND) LED45.3(GND) LED46.3(GND) LED47.3(GND) LED48.3(GND) LED49.3(GND) LED50.3(GND) LED51.3(GND) LED52.3(GND) LED53.3(GND) LED54.3(GND) ; also sheet 1
LEVELSHIFT_5V: LED1.4(DI) ; also sheet 1
N$3: LED36.2(DO) LED37.4(DI)
N$4: B7.P$2 D7.C
N$5: B11.P$2 D11.C
N$6: B1.P$2 D1.C
N$7: LED17.2(DO) LED18.4(DI)
N$8: LED18.2(DO) LED19.4(DI)
N$9: B4.P$2 D4.C
N$10: LED19.2(DO) LED20.4(DI)
N$11: LED1.2(DO) LED2.4(DI)
N$12: LED2.2(DO) LED3.4(DI)
N$13: LED3.2(DO) LED4.4(DI)
N$14: LED4.2(DO) LED5.4(DI)
N$15: B8.P$2 D8.C
N$16: LED5.2(DO) LED6.4(DI)
N$17: LED6.2(DO) LED7.4(DI)
N$18: B12.P$2 D12.C
N$19: LED7.2(DO) LED8.4(DI)
N$20: B2.P$2 D2.C
N$21: LED8.2(DO) LED9.4(DI)
N$22: B5.P$2 D5.C
N$23: B9.P$2 D9.C
N$24: B13.P$2 D13.C
N$25: B3.P$2 D3.C
N$26: B6.P$2 D6.C
N$27: B10.P$2 D10.C
N$28: B14.P$2 D14.C
N$29: LED9.2(DO) LED10.4(DI)
N$30: LED10.2(DO) LED11.4(DI)
N$31: LED11.2(DO) LED12.4(DI)
N$32: LED12.2(DO) LED13.4(DI)
N$33: LED13.2(DO) LED14.4(DI)
N$34: LED14.2(DO) LED15.4(DI)
N$35: LED15.2(DO) LED16.4(DI)
N$36: LED20.2(DO) LED21.4(DI)
N$37: LED21.2(DO) LED22.4(DI)
N$38: LED22.2(DO) LED23.4(DI)
N$39: LED23.2(DO) LED24.4(DI)
N$40: LED24.2(DO) LED25.4(DI)
N$41: LED25.2(DO) LED26.4(DI)
N$42: LED26.2(DO) LED27.4(DI)
N$43: LED28.2(DO) LED29.4(DI)
N$44: LED27.2(DO) LED28.4(DI)
N$45: LED29.2(DO) LED30.4(DI)
N$46: LED30.2(DO) LED31.4(DI)
N$47: LED31.2(DO) LED32.4(DI)
N$48: B15.P$2 D15.C
N$49: LED34.2(DO) LED35.4(DI)
N$50: LED35.2(DO) LED36.4(DI)
N$51: LED44.2(DO) LED45.4(DI)
N$52: B16.P$2 D16.C
N$53: B19.P$2 D19.C
N$54: B22.P$2 D22.C
N$55: LED43.2(DO) LED44.4(DI)
N$56: B17.P$2 D17.C
N$57: B20.P$2 D20.C
N$58: B23.P$2 D23.C
N$59: LED42.2(DO) LED43.4(DI)
N$60: B18.P$2 D18.C
N$61: B21.P$2 D21.C
N$62: B24.P$2 D24.C
N$64: LED16.2(DO) LED17.4(DI)
N$65: LED50.2(DO) LED51.4(DI)
N$67: LED51.2(DO) LED52.4(DI)
N$68: LED52.2(DO) LED53.4(DI)
N$70: B29.P$2 D29.C
N$73: B25.P$2 D25.C
N$75: B33.P$2 D33.C
N$76: B36.P$2 D36.C
N$81: B26.P$2 D26.C
N$82: B30.P$2 D30.C
N$83: B34.P$2 D34.C
N$84: B37.P$2 D37.C
N$85: B27.P$2 D27.C
N$86: B31.P$2 D31.C
N$87: B35.P$2 D35.C
N$88: B38.P$2 D38.C
N$89: LED33.2(DO) LED34.4(DI)
N$93: LED37.2(DO) LED38.4(DI)
N$94: LED38.2(DO) LED39.4(DI)
N$95: LED39.2(DO) LED40.4(DI)
N$96: LED41.2(DO) LED42.4(DI)
N$100: LED45.2(DO) LED46.4(DI)
N$101: LED46.2(DO) LED47.4(DI)
N$102: LED47.2(DO) LED48.4(DI)
N$103: LED49.2(DO) LED50.4(DI)
N$107: LED53.2(DO) LED54.4(DI)
N$111: LED40.2(DO) LED41.4(DI)
N$112: LED48.2(DO) LED49.4(DI)
N$113: LED32.2(DO) LED33.4(DI)
N$117: B46.P$2 D46.C
N$118: B50.P$2 D50.C
N$119: B40.P$2 D40.C
N$120: B43.P$2 D43.C
N$121: B47.P$2 D47.C
N$122: B51.P$2 D51.C
N$123: B41.P$2 D41.C
N$124: B44.P$2 D44.C
N$125: B48.P$2 D48.C
N$126: B52.P$2 D52.C
N$127: B42.P$2 D42.C
N$128: B45.P$2 D45.C
N$129: B49.P$2 D49.C
N$130: B53.P$2 D53.C
N$131: B28.P$2 D28.C
N$132: B32.P$2 D32.C
N$134: B39.P$2 D39.C
N$138: B54.P$2 D54.C
ROW0: D7.A D11.A D15.A D46.A D50.A ; also sheet 1
ROW1: D1.A D4.A D8.A D12.A D16.A D19.A D22.A D25.A D33.A D36.A D40.A D43.A D47.A D51.A ; also sheet 1
ROW2: D2.A D5.A D9.A D13.A D17.A D20.A D23.A D26.A D30.A D34.A D37.A D41.A D44.A D48.A D52.A ; also sheet 1
ROW3: D3.A D6.A D10.A D14.A D18.A D21.A D24.A D27.A D31.A D35.A D38.A D42.A D45.A D49.A D53.A ; also sheet 1
ROW4: D28.A D29.A D32.A D39.A D54.A ; also sheet 1
VDD [power]: LED1.1(VDD) LED2.1(VDD) LED3.1(VDD) LED4.1(VDD) LED5.1(VDD) LED6.1(VDD) LED7.1(VDD) LED8.1(VDD) LED9.1(VDD) LED10.1(VDD) LED11.1(VDD) LED12.1(VDD) LED13.1(VDD) LED14.1(VDD) LED15.1(VDD) LED16.1(VDD) LED17.1(VDD) LED18.1(VDD) LED19.1(VDD) LED20.1(VDD) LED21.1(VDD) LED22.1(VDD) LED23.1(VDD) LED24.1(VDD) LED25.1(VDD) LED26.1(VDD) LED27.1(VDD) LED28.1(VDD) LED29.1(VDD) LED30.1(VDD) LED31.1(VDD) LED32.1(VDD) LED33.1(VDD) LED34.1(VDD) LED35.1(VDD) LED36.1(VDD) LED37.1(VDD) LED38.1(VDD) LED39.1(VDD) LED40.1(VDD) LED41.1(VDD) LED42.1(VDD) LED43.1(VDD) LED44.1(VDD) LED45.1(VDD) LED46.1(VDD) LED47.1(VDD) LED48.1(VDD) LED49.1(VDD) LED50.1(VDD) LED51.1(VDD) LED52.1(VDD) LED53.1(VDD) LED54.1(VDD) ; also sheet 1
Unconnected: LED54.2(DO)

## Power pins joined to a net without a drawn wire
VSW: U2.55(VSW)

## Library data of the parts
B1-B54 = microbuilder:ELAST_10X10: 10mm x 10mm elastomer pad
C1 = SparkFun-Capacitors:4.7UF: 4.7µF ceramic capacitors A capacitor is a passive two-terminal electrical component used to store electrical energy temporarily in an electric field.; PROD_ID: CAP-08280
C2-C13 = microbuilder:CAP_CERAMIC: Ceramic Capacitors For new designs, use the packages preceded by an '_' character since they are more reliable: The following footprints should be used on most boards: _0402 - Standard footprint for regular board layouts _0603 - Standard footprint for regular board layouts _0805 - Standard footprint for regular board layouts _1206 - Standard footprint for regular board layouts For extremely tight-pitch boards where space is at a premium, the following 'micro-pitch' footprints can be used (smaller pads, no silkscreen outline, etc.): _0402MP - Micro-pitch footprint for very dense/compact boards _0603MP - Micro-pitch footprint for very dense/compact boards _0805MP - Micro-pitch footprint for very dense/compact boards _1206MP - Micro-pitch footprint for very dense/compact boards
C15-C19 = SparkFun-Capacitors:0.1UF: 0.1µF ceramic capacitors A capacitor is a passive two-terminal electrical component used to store electrical energy temporarily in an electric field.; PROD_ID: CAP-00810
D1-D54 = microbuilder:DIODE: Diode SMA Model Volts Amps Type Vf Ir Digikey # Notes SSA34-E3 40V 3A Schottky 480mV @ 3A 200uA @ 40V SSA34-E3/61TGITR-ND CDBA120-G 20V 1A Schottky 500mV @ 1A 500uA @ 20V 641-1014-6-ND REEL MBRA210 10V 2A Schottky 350mV @ 2A 700uA @ 10V MBRA210LT3 SOD-123 Model Volts Amps Type Vf Ir Order # Notes BAT54T1G 30V 200mA Schottky 800mV @ 200mA 2uA @ 25V BAT54T1GOSTR-ND B0530W 30V 500mA Schottky 430mV @ 500mA 130uA @ 30V B0530W-FDICT-ND REEL MBR120 20V 1A Schottky 340mV @ 1A MBR120VLSFT1GOSCT-ND SOD-323 Model Volts Amps Type Vf Ir Order # Notes PMEG2005EJ 20V 500mA Schottky 355mV @ 500mA 568-4110-1-ND ZLLS410 10V 570mA Schottky 380mV @ 570mA ZLLS410CT-ND 1N4148WS 75V 150mA Silicon/Simple 1V 1N4148WSFSCT-ND REEL SOD-523 Model Volts Amps Type Vf Ir Order # Notes BAT54XV2 30V 200mA Schottky 0.8V @ 100mA BAT54XV2CT-ND TB751S 30V 30mA Schottky RB751S-40TE61CT-ND SOT23-R/W (R = Solder Paste/Reflow Ovens, W = Hand-Soldering) Model Volts Amps Type Vf Ir Order # Notes BAT54FILM 40V 300mA Schottky 497-7162-1-ND POWERDI-5 Model Volts Amps Type Vf Ir Order # Notes PDS560 60V 5A Schottky 670mV @ 5A 150uA @ 60V PDS560DICT-ND
D55-D58 = diode:DIODE-: DIODE
FB1 = microbuilder:FERRITE: Ferrite Bead 0603 MMZ1608B121C - 120 Ohm @ 100MHz, 600mA, 0.15 Ohm DC Resistance - Digikey: 445-2164-1-ND BK1608HW121-T - 120 Ohm, 600mA Ferrite Chip - Digikey: 587-1876-2-ND 0805 HZ0805B272R-10 - 2.7K Ohm @ 100MHz, 200mA, 0.8 Ohm DC Resistance - Digikey: 240-2504-1-ND (see also Murata BLM21BD272SN1L) MMZ2012Y152B - 1.5K Ohm @ 100MHz, 500mA, 0.4 Ohm DC Resistance - Digikey: 445-1560-1-ND - Mainly for high frequency (80-400MHz) MMZ2012R102A - 1K Ohm @ 100MHz, 500mA, 0.3 Ohm DC Resistance - Digikey: 445-1555-2-ND - More general purpose (10-200MHz)
J3 = FTSH-105-01-L-DV-K:FTSH-105-01-L-DV-K: Conn Unshrouded Header HDR 10 POS 1.27mm Solder ST SMD Automotive Tube; AVAILABILITY: Unavailable; DESCRIPTION: Conn Unshrouded Header HDR 10 POS 1.27mm Solder ST SMD Automotive Tube; MF: Samtec; MP: FTSH-105-01-L-DV-K; PACKAGE: TSSOP-20 Texas Instruments; PRICE: None
J4 = SparkFun-Connectors:USB_MICRO-B: USB Type Micro-B Connector Male/female and PTH/SMT variants SparkFun Products: SparkFun microB USB Breakout <https://www.sparkfun.com/products/12035> SparkFun USB microB Plug Breakout <https://www.sparkfun.com/products/10031> SparkFun ESP8266 Thing <https://www.sparkfun.com/products/13231>; PROD_ID: CONN-13711
LED1-LED54 = adafruit:WS2812B
MIDIOUTA MIDIOUTB = SparkFun-Connectors:AUDIO_JACK_2.5MM: Audio Jack 2.5mm variants of PTH and SMT audio jacks. SparkFun Products: SparkFun PicoBoard <https://www.sparkfun.com/products/11888>- 2.5mm SMD; PROD_ID: CONN-10062
PTC1 = microbuilder:PTC: PTC (Resettable Fuse) 1206 Package 250mA PTC (16V Max, Time-to-Trip: 0.08s) - Digikey: F2110CT-ND 1210 Package 100mA PTC (30V Max, Time-to-Trip: 0.6s) - Digikey: MF-USMF010-2CT-ND 1812 Package 750mA PTC (24V Max, Time-to-Trip: 0.2s) - Digikey: MF-MSMF075/24-2CT-ND
R1 = microbuilder:RESISTOR_4PACK: Resistor Packs (4 resistors) 4 x 0603 10K 1/16W - Digikey: YC164J-10KCT-ND
R2-R6 R8-R10 = SparkFun-Resistors:220OHM-1/10W-1%(0603): RES-07861; PROD_ID: RES-07861; VALUE: 220
R7 = microbuilder:RESISTOR: Resistors For new designs, use the packages preceded by an '_' character since they are more reliable: The following footprints should be used on most boards: _0402 - Standard footprint for regular board layouts _0603 - Standard footprint for regular board layouts _0805 - Standard footprint for regular board layouts _1206 - Standard footprint for regular board layouts For extremely tight-pitch boards where space is at a premium, the following 'micro-pitch' footprints can be used (smaller pads, no silkscreen outline, etc.): _0402MP - Micro-pitch footprint for very dense/compact boards _0603MP - Micro-pitch footprint for very dense/compact boards _0805MP - Micro-pitch footprint for very dense/compact boards _1206MP - Micro-pitch footprint for very dense/compact boards
SW2 = adafruit:SPST_TACT: SMT 6mm switch, EVQQ2 series http://www.ladyada.net/library/eagle
TP1-TP3 TP5-TP8 TP10 TP12-TP37 = microbuilder:TESTPOINT: Test Point Various test points for characterisation and PCB testing TESTPOINT_SMT - Compact Surface Mount Test Point [Digikey: 5016KTR-ND]
U1 = microbuilder:VREG_SOT23-5: SOT23-5 Fixed Voltage Regulators Part Current Out V Out V In V Dropout θJA (°C/W) TJ (°C) Digikey Part No. ADP121 150mA 3.3V 3.4-5.5V 0.09V @ 150mA -- -- ADP121-AUJZ33R7CT-ND ADP121 150mA 3.0V 3.1-5.5V 0.09V @ 150mA -- -- ADP121-AUJZ30R7CT-ND ADP122 300mA 3.3V 3.4-5.5V 0.085V @ 300mA -- -- ADP122AUJZ-3.3-R7CT-ND ADP1712 300mA 3.3V 3.5-5.5V 0.17V @ 300mA -- -- ADP1712AUJZ-3.3-R7TR-ND AP7311 (Low Cost) 150mA 3.3V 3.5-6V 0.15V @ 150mA -- -- AP7311-33WG-7DICT-ND LD39015M18R 150mA 1.8V 1.9V-5.5V 0.08V @ 100mA -- -- 497-6977-1-ND LP2985A-33DBVR 150mA 3.3V 3.3-16V 0.28V @ 150mA 206 150 296-18479-1-ND MCP1824T-3302E/OT 300mA 3.3V 3.5V-6V 0.2V @ 300mA -- -- MCP1824T-3302E/OTCT-ND MIC5205-2.5YM5 TR 150mA 2.5V 2.7-16V 0.165V @ 150mA -- -- 576-1257-2-ND MIC5205-3.0YM5 TR 150mA 3.0V 3.2V-16V 0.165V @ 150mA -- -- 576-1258-2-ND MIC5205-3.3YM5 TR 150mA 3.3V 3.5V-16V 0.165V @ 150mA -- -- 576-1259-2-ND TPS780330220 150mA 3.3V+2.2V 3.6-5.5V 250mV Max -- -- 296-23332-1-ND TDA3663/N1,135 100mA 3.3V 3.5-45V 0.18V @ 50mA -- -- 568-5343-1-ND Max operating temp can be calculated using θJA, TJ (max junction temperature), and power in watts. Set the "Maximum Ambient Temperature" until it reaches TJ ("Max Junction Temperature"), which is the absolute limit for safe use of the regulator: Heat Sink Temperature Calculator <http://www.daycounter.com/Calculators/Heat-Sink-Temperature-Calculator.phtml> For example, With 12V source into a 3.3V LP2985 and a 30mA load, we are dissipating (12V-3.3V) * 0.03A = 0.261W. With a θJA of 206 °C/W, a TJ of 150°C, and 261mW we can safely use the chip without a heat sink up to 75°C (=147.1°C Junction Temperature).
U2 = ATSAMD51J19A-AUT:ATSAMD51J19A-AUT: ARM® Cortex®-M4F SAM D51 Microcontroller IC 32-Bit 120MHz 512KB (512K x 8) FLASH 64-TQFP (10x10); AVAILABILITY: Unavailable; DESCRIPTION: 120Mhz 512Kb F 64 Tqfp Pkg T Nr 85Ct 64 Tqfp 10 10 1 T/R; MF: Microchip; MP: ATSAMD51J19A-AUT; PACKAGE: TQFP-64 Microchip; PRICE: None
U3 = SN74LV4T125PWR:SN74LV4T125PWR: Single Power Supply Quadruple Buffer GATE w/ 3-State Output CMOS Logic Level Shifter 14-TSSOP -40 to 125; DESCRIPTION: Buffer, Non-Inverting 4 Element 1 Bit per Element 3-State Output 14-TSSOP; DIGI-KEY_PART_NUMBER: 296-40545-1-ND; DIGI-KEY_PURCHASE_URL: https://www.digikey.com/product-detail/en/texas-instruments/SN74LV4T125PWR/296-40545-1-ND/5178422?utm_source=snapeda&utm_medium=aggregator&utm_campaign=symbol; MF: Texas Instruments; MP: SN74LV4T125PWR; PACKAGE: TSSOP-14 Texas Instruments
Y1 = ECS-.327-12.5-17X-TR:ECS-.327-12.5-17X-TR: Crystal 4-SOJ, 5.50mm pitch; DESCRIPTION: 32.768kHz ±20ppm Crystal 12.5pF 50 kOhms 4-SOJ, 5.50mm pitch; DIGI-KEY_PART_NUMBER: XC1195CT-ND; DIGI-KEY_PURCHASE_URL: https://www.digikey.com/product-detail/en/ecs-inc/ECS-.327-12.5-17X-TR/XC1195CT-ND/827659?utm_source=snapeda&utm_medium=aggregator&utm_campaign=symbol; MF: ECS Inc.; MP: ECS-.327-12.5-17X-TR; PACKAGE: 4-4 ECS International

## Net classes
1 power: width 0.406 mm